# Altium project manette.PrjPcb
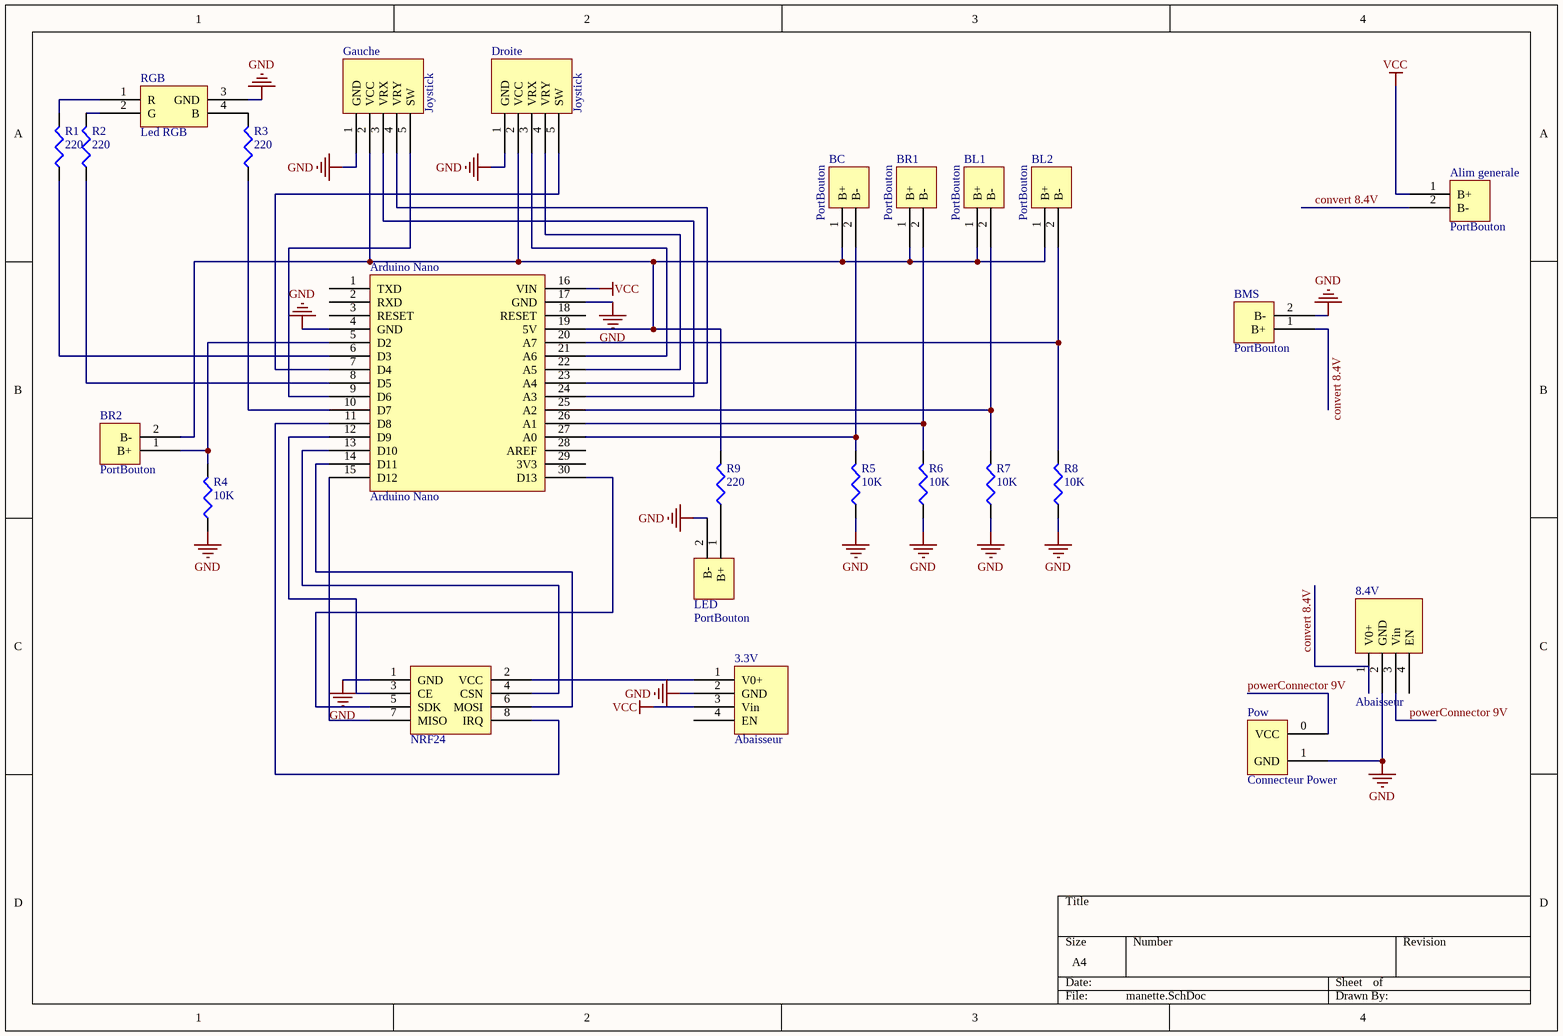
[diagram p0: manette.SchDoc]
1 sheet, 25 parts. Net scope: global (net labels, ports and power ports of the same name join across sheets).
Board file: manette.PCBDOC

## Sheet manette.SchDoc
size A4

### Parts
3.3V  Abaisseur  [AbaisseurTension]
8.4V  Abaisseur  [AbaisseurTension]
Alim_generale  PortBouton  [PortBouton]
Arduino_Nano  Arduino Nano  [Arduino Nano]
BC  PortBouton  [PortBouton]
BL1  PortBouton  [PortBouton]
BL2  PortBouton  [PortBouton]
BMS  PortBouton  [PortBouton]
BR1  PortBouton  [PortBouton]
BR2  PortBouton  [PortBouton]
Droite  Joystick  [Joystick]
Gauche  Joystick  [Joystick]
LED  PortBouton  [PortBouton]
NRF24  NRF24  [NRF24]  (value not drawn)
Pow  Connecteur Power  [Connecteur Power]
R1  value 220  [0805]  (hidden comment: RES)
R2  value 220  [0805]  (hidden comment: RES)
R3  value 220  [0805]  (hidden comment: RES)
R4  value 10K  [0805]  (hidden comment: RES)
R5  value 10K  [0805]  (hidden comment: RES)
R6  value 10K  [0805]  (hidden comment: RES)
R7  value 10K  [0805]  (hidden comment: RES)
R8  value 10K  [0805]  (hidden comment: RES)
R9  value 220  [0805]  (hidden comment: RES)
RGB  Led RGB  [Led RGB]

### Nets
GND: 3.3V.2(GND) 8.4V.2(GND) Arduino_Nano.4(GND) Arduino_Nano.17(GND) BMS.2(B-) Droite.1(GND) Gauche.1(GND) LED.2(B-) NRF24.1(GND) Pow.1(GND) R4.1 R5.1 R6.1 R7.1 R8.1 RGB.3(GND)
VCC: 3.3V.3(Vin) Alim_generale.1(B+) Arduino_Nano.16(VIN)
convert 8.4V: 8.4V.1(V0+) Alim_generale.2(B-) BMS.1(B+)
powerConnector 9V: 8.4V.3(Vin) Pow.0(VCC)
Net3.3V_1: 3.3V.1(V0+) NRF24.2(VCC)
NetArduino_Nano_5: Arduino_Nano.5(D2) BR2.1(B+) R4.2
NetArduino_Nano_6: Arduino_Nano.6(D3) R1.1
NetArduino_Nano_7: Arduino_Nano.7(D4) Droite.5(SW)
NetArduino_Nano_8: Arduino_Nano.8(D5) R2.1
NetArduino_Nano_9: Arduino_Nano.9(D6) Gauche.5(SW)
NetArduino_Nano_10: Arduino_Nano.10(D7) R3.1
NetArduino_Nano_11: Arduino_Nano.11(D8) NRF24.8(IRQ)
NetArduino_Nano_12: Arduino_Nano.12(D9) NRF24.3(CE)
NetArduino_Nano_13: Arduino_Nano.13(D10) NRF24.4(CSN)
NetArduino_Nano_14: Arduino_Nano.14(D11) NRF24.6(MOSI)
NetArduino_Nano_15: Arduino_Nano.15(D12) NRF24.7(MISO)
NetArduino_Nano_19: Arduino_Nano.19(5V) BC.1(B+) BL1.1(B+) BL2.1(B+) BR1.1(B+) BR2.2(B-) Droite.2(VCC) Gauche.2(VCC) R9.2
NetArduino_Nano_20: Arduino_Nano.20(A7) BL2.2(B-) R8.2
NetArduino_Nano_21: Arduino_Nano.21(A6) Droite.3(VRX)
NetArduino_Nano_22: Arduino_Nano.22(A5) Droite.4(VRY)
NetArduino_Nano_23: Arduino_Nano.23(A4) Gauche.4(VRY)
NetArduino_Nano_24: Arduino_Nano.24(A3) Gauche.3(VRX)
NetArduino_Nano_25: Arduino_Nano.25(A2) BL1.2(B-) R7.2
NetArduino_Nano_26: Arduino_Nano.26(A1) BR1.2(B-) R6.2
NetArduino_Nano_27: Arduino_Nano.27(A0) BC.2(B-) R5.2
NetArduino_Nano_30: Arduino_Nano.30(D13) NRF24.5(SDK)
NetLED_1: LED.1(B+) R9.1
NetR1_2: R1.2 RGB.1(R)
NetR2_2: R2.2 RGB.2(G)
NetR3_2: R3.2 RGB.4(B)

Not connected (* = marked no-connect by the designer): 3.3V 4(EN); 8.4V 4(EN); Arduino_Nano 1(TXD) 2(RXD) 3(RESET) 18(RESET) 28(AREF) 29(3V3)

### Library data of the parts
R1-R9 = RES: resistance